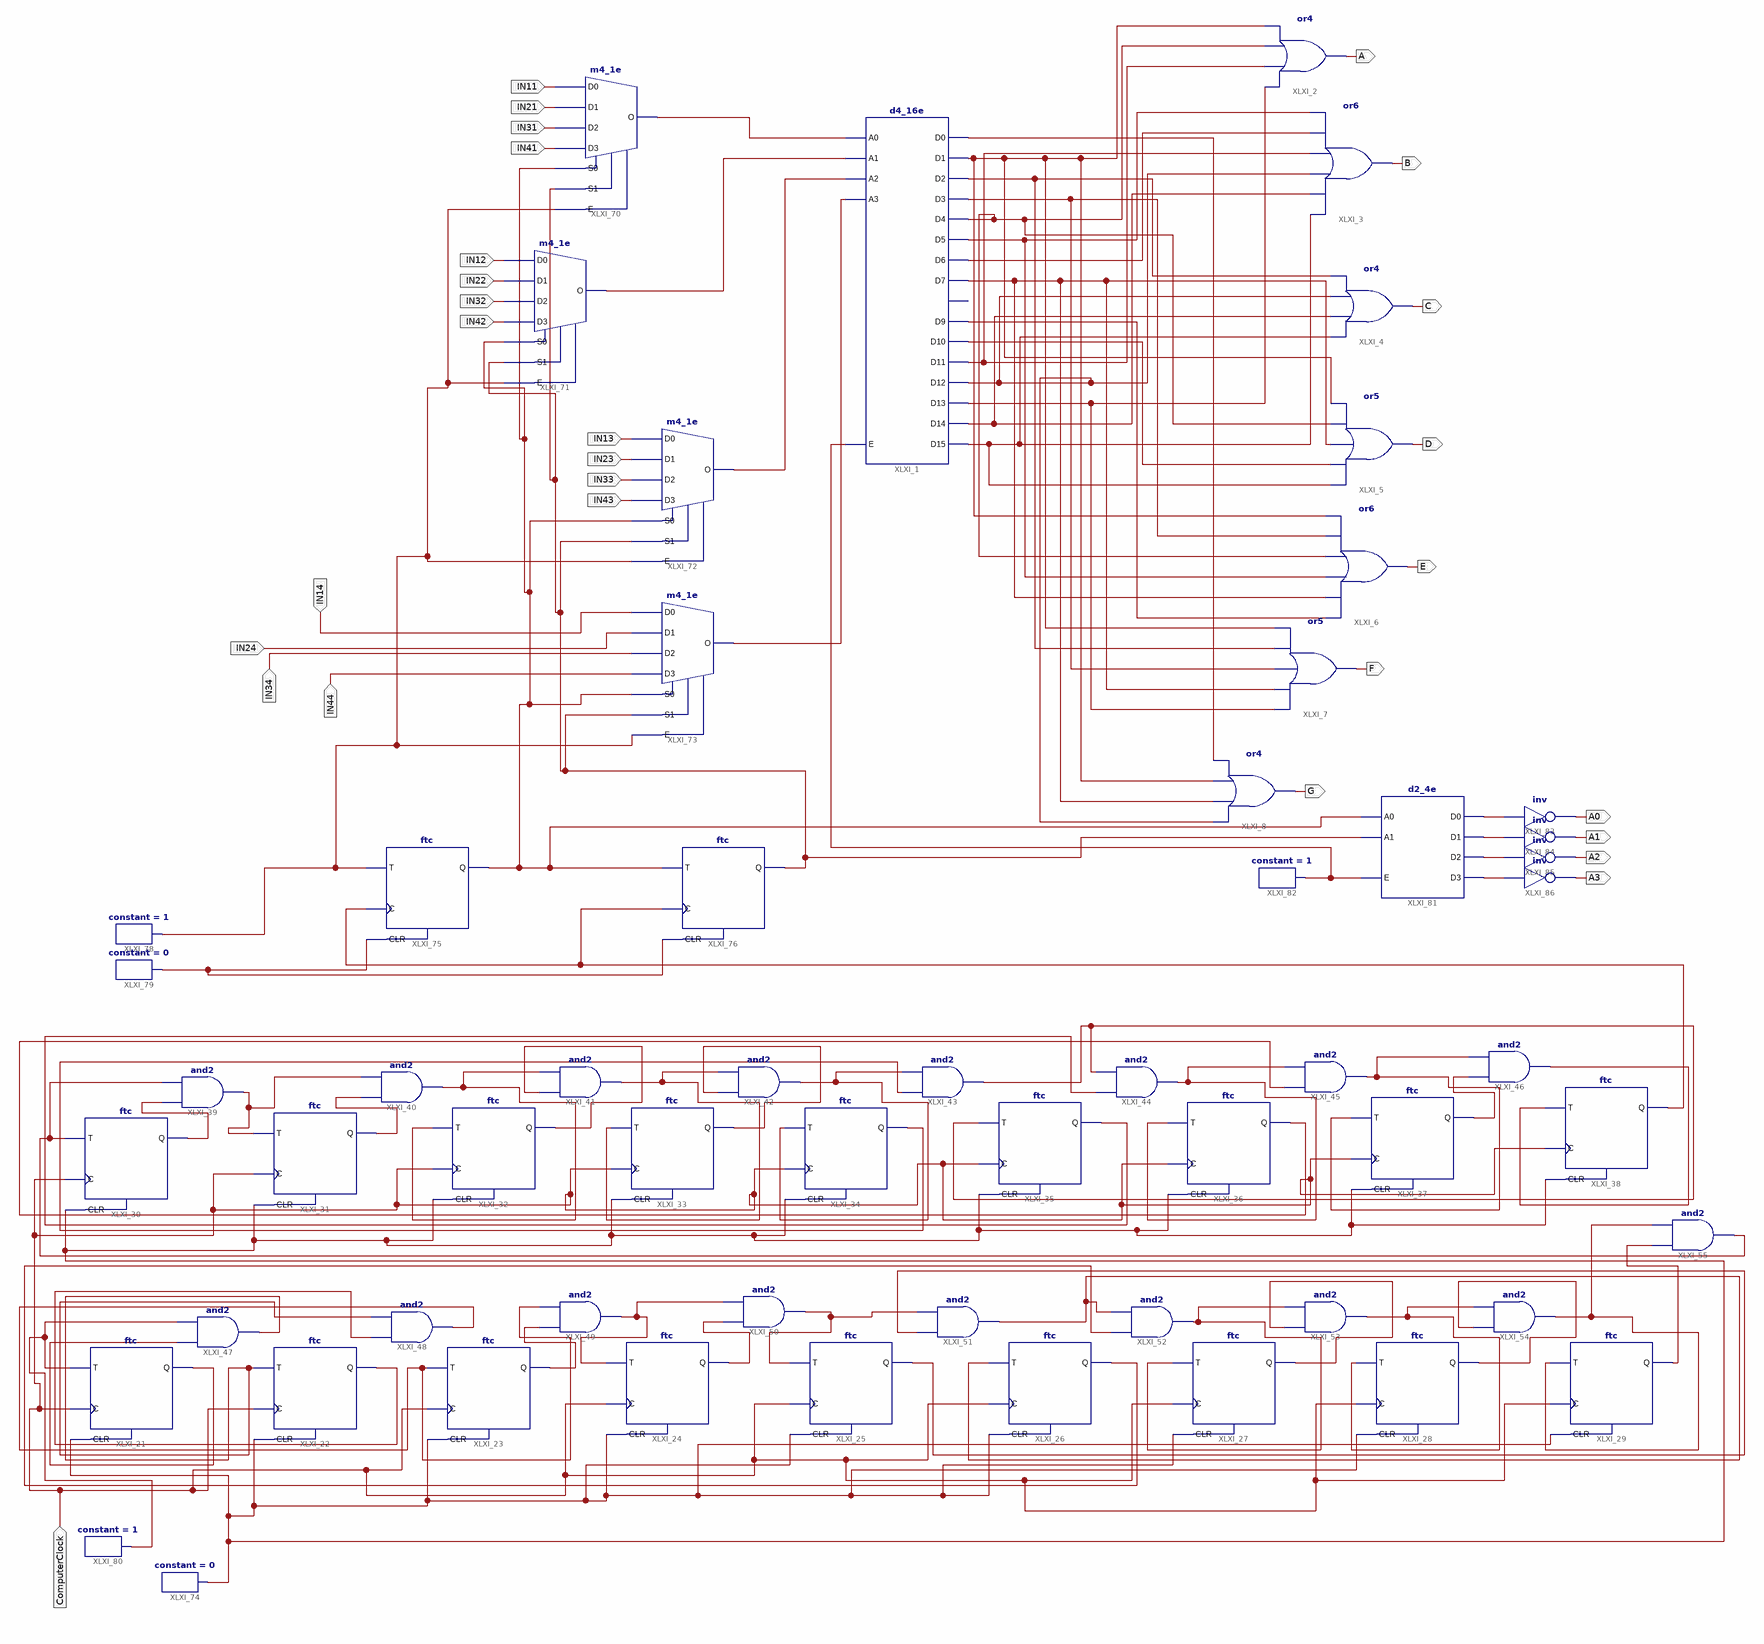
[diagram p0: schematic sheet 1]
// Xilinx ISE schematic seg.sch (spartan6) as structural Verilog: 59 symbols, 28 ports
module seg (
  input  IN44,
  input  IN34,
  input  IN24,
  input  IN14,
  input  IN43,
  input  IN33,
  input  IN23,
  input  IN13,
  input  IN42,
  input  IN32,
  input  IN22,
  input  IN12,
  input  IN41,
  input  IN31,
  input  IN21,
  input  IN11,
  input  ComputerClock,
  output A3,
  output A2,
  output A1,
  output A0,
  output G,
  output F,
  output E,
  output D,
  output C,
  output B,
  output A
);

  wire XLXN_2, XLXN_3, XLXN_5, XLXN_8, XLXN_10, XLXN_11, XLXN_13, XLXN_14, XLXN_15, XLXN_16, XLXN_17,
       XLXN_18, XLXN_19, XLXN_20, XLXN_21, XLXN_50, XLXN_51, XLXN_52, XLXN_53, XLXN_54, XLXN_55, XLXN_57,
       XLXN_58, XLXN_59, XLXN_60, XLXN_61, XLXN_62, XLXN_64, XLXN_65, XLXN_67, XLXN_68, XLXN_70, XLXN_71,
       XLXN_75, XLXN_77, XLXN_78, XLXN_79, XLXN_81, XLXN_82, XLXN_84, XLXN_85, XLXN_87, XLXN_88, XLXN_89,
       XLXN_90, XLXN_92, XLXN_93, XLXN_95, XLXN_96, XLXN_97, XLXN_140, XLXN_147, XLXN_159, XLXN_160,
       XLXN_164, XLXN_167, XLXN_171, XLXN_174, XLXN_175, XLXN_176, XLXN_177, XLXN_199, XLXN_204, XLXN_213,
       XLXN_214;

  m4_1e XLXI_73 (.D0(IN14), .D1(IN24), .D2(IN34), .D3(IN44), .E(XLXN_171), .S0(XLXN_164), .S1(XLXN_167), .O(XLXN_204));
  m4_1e XLXI_72 (.D0(IN13), .D1(IN23), .D2(IN33), .D3(IN43), .E(XLXN_171), .S0(XLXN_164), .S1(XLXN_167), .O(XLXN_199));
  m4_1e XLXI_71 (.D0(IN12), .D1(IN22), .D2(IN32), .D3(IN42), .E(XLXN_171), .S0(XLXN_164), .S1(XLXN_167), .O(XLXN_214));
  not XLXI_86 (A3, XLXN_177);
  not XLXI_85 (A2, XLXN_176);
  not XLXI_84 (A1, XLXN_175);
  not XLXI_83 (A0, XLXN_174);
  constant #(.CValue("1")) XLXI_82 (.O(XLXN_213));
  d2_4e XLXI_81 (
    .A0(XLXN_164), .A1(XLXN_167), .E(XLXN_213), .D0(XLXN_174), .D1(XLXN_175), .D2(XLXN_176), .D3(XLXN_177));
  constant #(.CValue("1")) XLXI_80 (.O(XLXN_50));
  constant #(.CValue("0")) XLXI_79 (.O(XLXN_160));
  constant #(.CValue("0")) XLXI_74 (.O(XLXN_159));
  constant #(.CValue("1")) XLXI_78 (.O(XLXN_171));
  ftc XLXI_76 (.C(XLXN_147), .CLR(XLXN_160), .T(XLXN_164), .Q(XLXN_167));
  ftc XLXI_75 (.C(XLXN_147), .CLR(XLXN_160), .T(XLXN_171), .Q(XLXN_164));
  m4_1e XLXI_70 (.D0(IN11), .D1(IN21), .D2(IN31), .D3(IN41), .E(XLXN_171), .S0(XLXN_164), .S1(XLXN_167), .O(XLXN_140));
  or XLXI_8 (G, XLXN_8, XLXN_21, XLXN_20, XLXN_19);
  or XLXI_7 (F, XLXN_18, XLXN_21, XLXN_17, XLXN_16, XLXN_20);
  or XLXI_6 (E, XLXN_15, XLXN_21, XLXN_14, XLXN_2, XLXN_17, XLXN_20);
  or XLXI_5 (D, XLXN_13, XLXN_11, XLXN_21, XLXN_2, XLXN_20);
  or XLXI_4 (C, XLXN_13, XLXN_10, XLXN_8, XLXN_16);
  or XLXI_3 (B, XLXN_13, XLXN_10, XLXN_8, XLXN_5, XLXN_3, XLXN_14);
  or XLXI_2 (A, XLXN_18, XLXN_5, XLXN_2, XLXN_20);
  d4_16e XLXI_1 (
    .A0(XLXN_140), .A1(XLXN_214), .A2(XLXN_199), .A3(XLXN_204), .E(XLXN_213), .D0(XLXN_19), .D1(XLXN_20),
    .D10(XLXN_11), .D11(XLXN_5), .D12(XLXN_8), .D13(XLXN_18), .D14(XLXN_10), .D15(XLXN_13), .D2(XLXN_16),
    .D3(XLXN_17), .D4(XLXN_2), .D5(XLXN_14), .D6(XLXN_3), .D7(XLXN_21), .D9(XLXN_15));  // open: D8
  and XLXI_55 (XLXN_75, XLXN_71, XLXN_70);
  and XLXI_54 (XLXN_70, XLXN_68, XLXN_67);
  and XLXI_53 (XLXN_67, XLXN_65, XLXN_64);
  and XLXI_52 (XLXN_64, XLXN_62, XLXN_61);
  and XLXI_51 (XLXN_61, XLXN_60, XLXN_59);
  and XLXI_50 (XLXN_59, XLXN_58, XLXN_57);
  and XLXI_49 (XLXN_57, XLXN_55, XLXN_54);
  and XLXI_48 (XLXN_54, XLXN_53, XLXN_52);
  and XLXI_47 (XLXN_52, XLXN_51, XLXN_50);
  and XLXI_46 (XLXN_97, XLXN_96, XLXN_95);
  and XLXI_45 (XLXN_95, XLXN_92, XLXN_93);
  and XLXI_44 (XLXN_93, XLXN_90, XLXN_89);
  and XLXI_43 (XLXN_89, XLXN_88, XLXN_87);
  and XLXI_42 (XLXN_87, XLXN_85, XLXN_84);
  and XLXI_41 (XLXN_84, XLXN_82, XLXN_81);
  and XLXI_40 (XLXN_81, XLXN_79, XLXN_78);
  and XLXI_39 (XLXN_78, XLXN_77, XLXN_75);
  ftc XLXI_38 (.C(ComputerClock), .CLR(XLXN_159), .T(XLXN_97), .Q(XLXN_147));
  ftc XLXI_37 (.C(ComputerClock), .CLR(XLXN_159), .T(XLXN_95), .Q(XLXN_96));
  ftc XLXI_36 (.C(ComputerClock), .CLR(XLXN_159), .T(XLXN_93), .Q(XLXN_92));
  ftc XLXI_35 (.C(ComputerClock), .CLR(XLXN_159), .T(XLXN_89), .Q(XLXN_90));
  ftc XLXI_34 (.C(ComputerClock), .CLR(XLXN_159), .T(XLXN_87), .Q(XLXN_88));
  ftc XLXI_33 (.C(ComputerClock), .CLR(XLXN_159), .T(XLXN_84), .Q(XLXN_85));
  ftc XLXI_32 (.C(ComputerClock), .CLR(XLXN_159), .T(XLXN_81), .Q(XLXN_82));
  ftc XLXI_31 (.C(ComputerClock), .CLR(XLXN_159), .T(XLXN_78), .Q(XLXN_79));
  ftc XLXI_30 (.C(ComputerClock), .CLR(XLXN_159), .T(XLXN_75), .Q(XLXN_77));
  ftc XLXI_29 (.C(ComputerClock), .CLR(XLXN_159), .T(XLXN_70), .Q(XLXN_71));
  ftc XLXI_28 (.C(ComputerClock), .CLR(XLXN_159), .T(XLXN_67), .Q(XLXN_68));
  ftc XLXI_27 (.C(ComputerClock), .CLR(XLXN_159), .T(XLXN_64), .Q(XLXN_65));
  ftc XLXI_26 (.C(ComputerClock), .CLR(XLXN_159), .T(XLXN_61), .Q(XLXN_62));
  ftc XLXI_25 (.C(ComputerClock), .CLR(XLXN_159), .T(XLXN_59), .Q(XLXN_60));
  ftc XLXI_24 (.C(ComputerClock), .CLR(XLXN_159), .T(XLXN_57), .Q(XLXN_58));
  ftc XLXI_23 (.C(ComputerClock), .CLR(XLXN_159), .T(XLXN_54), .Q(XLXN_55));
  ftc XLXI_22 (.C(ComputerClock), .CLR(XLXN_159), .T(XLXN_52), .Q(XLXN_53));
  ftc XLXI_21 (.C(ComputerClock), .CLR(XLXN_159), .T(XLXN_50), .Q(XLXN_51));
endmodule
